# EAGLE schematic gatedriver_trafo_sma_compact_ACDC_ultra (EAGLE 7.2.0)
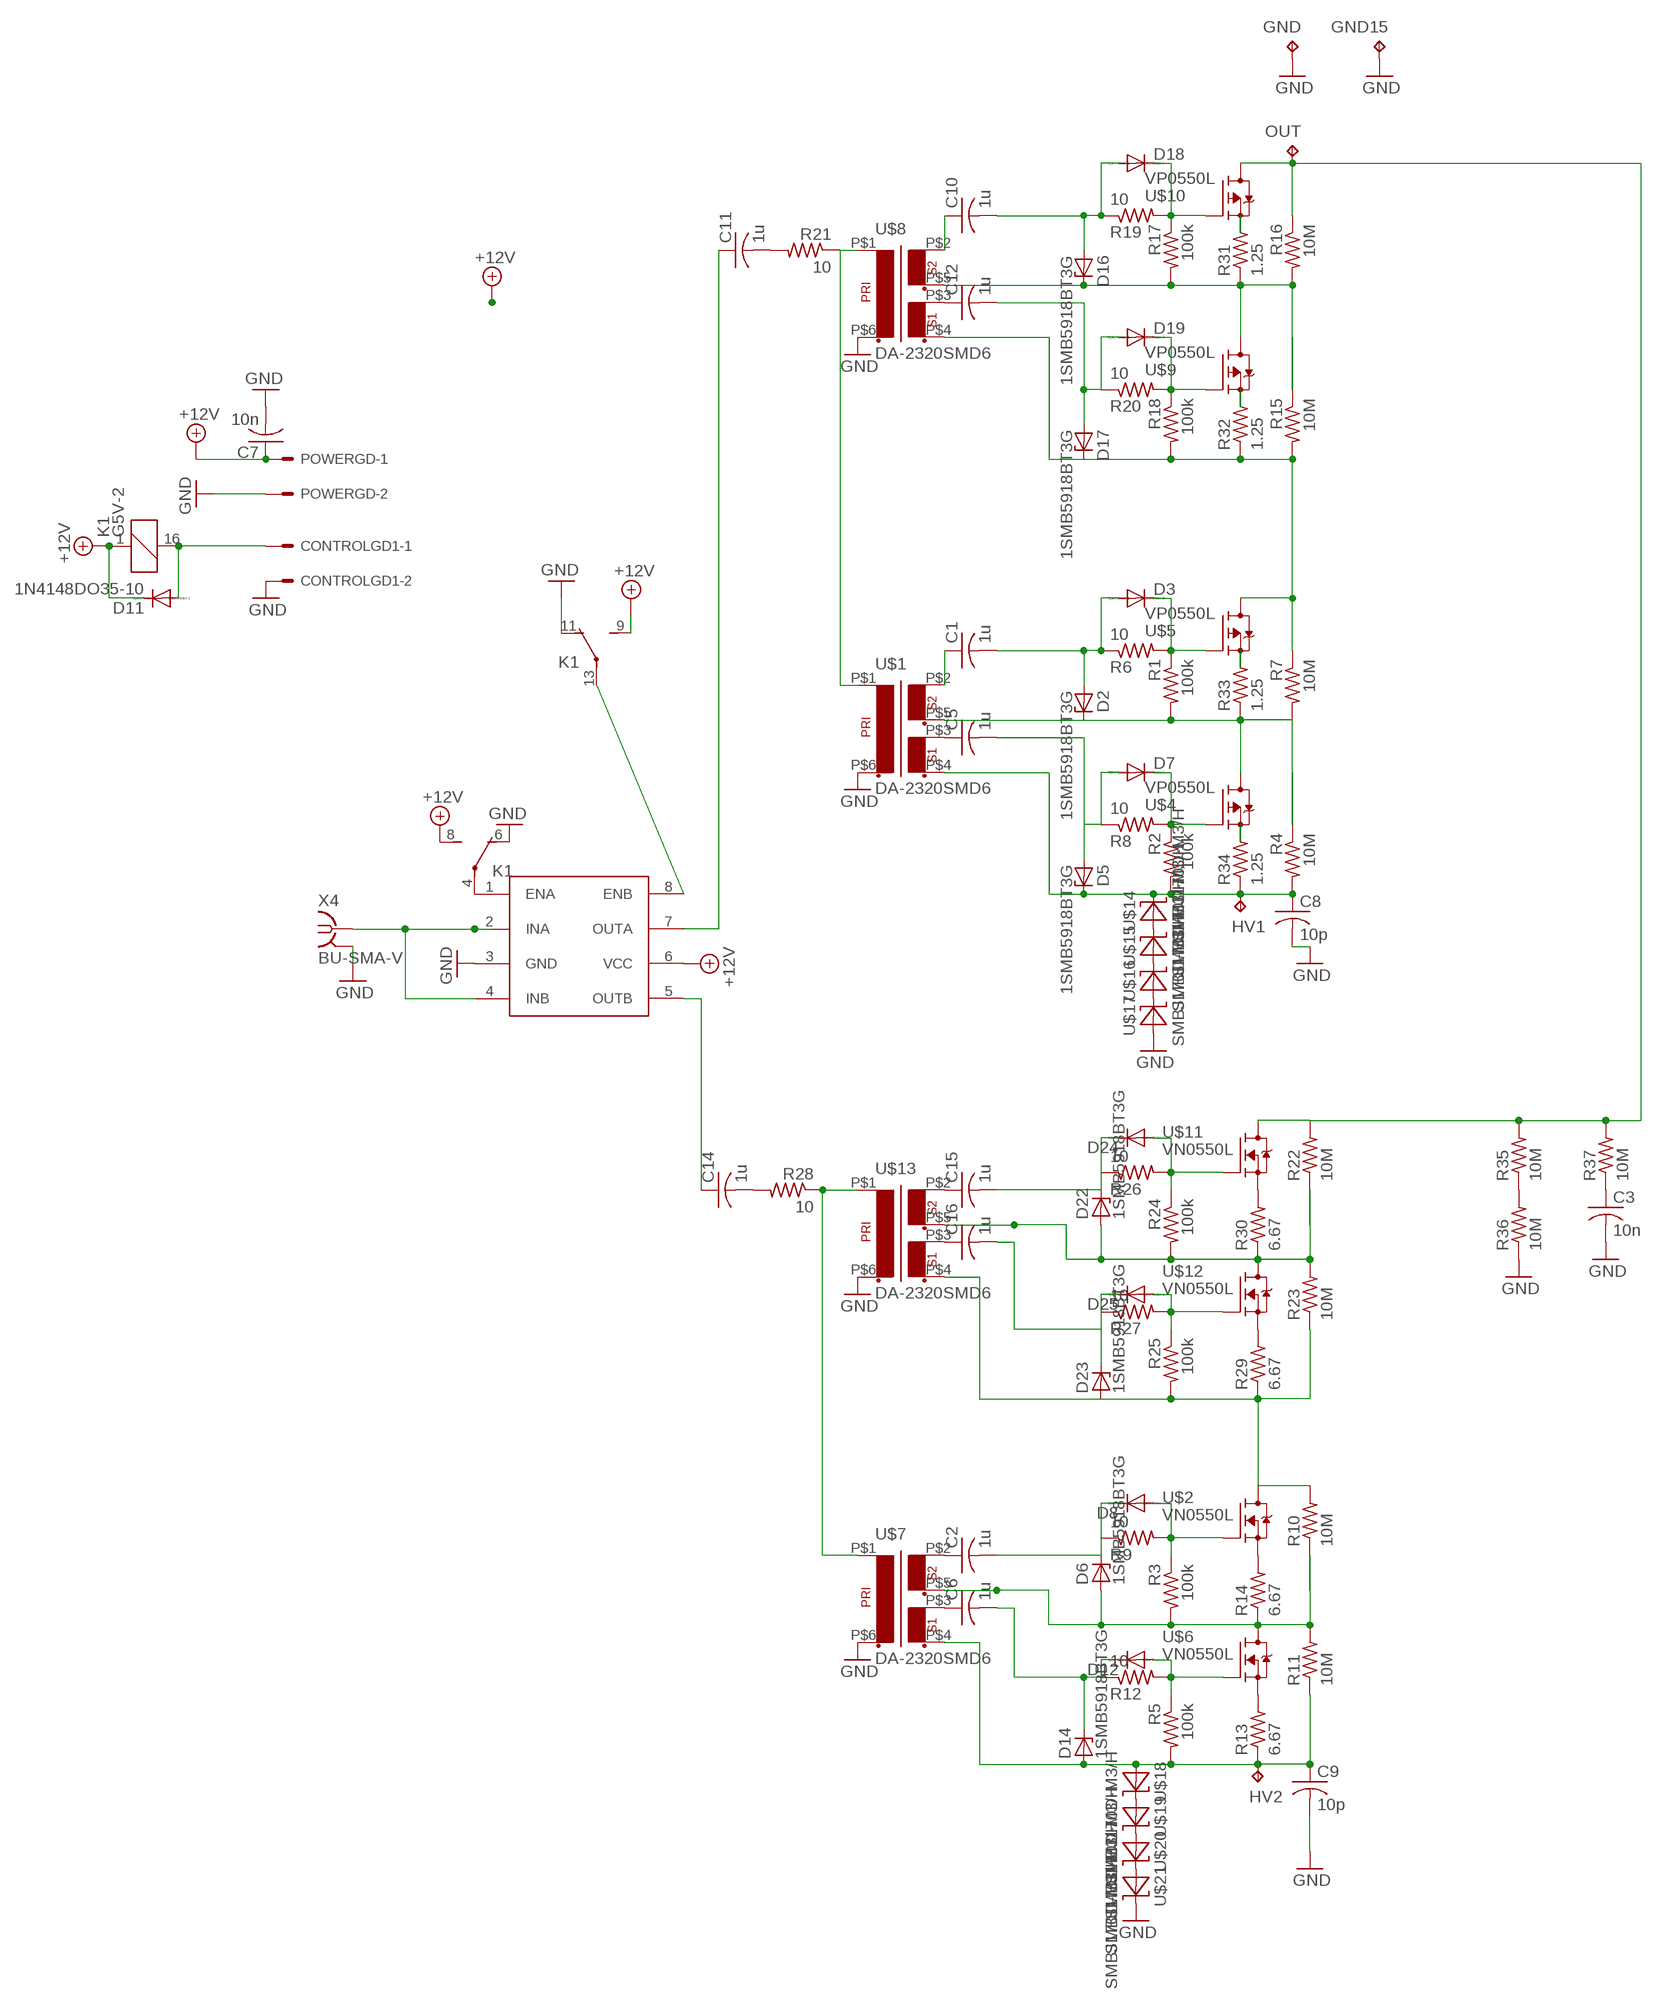
[diagram p0: schematic, sheet 1]

## Parts
C1  1u  C-USC0805  [C0805]
C2  1u  C-USC0805  [C0805]
C3  10n  C-USC0805  [C0805]
C5  1u  C-USC0805  [C0805]
C6  1u  C-USC0805  [C0805]
C7  10n  C-US050-030X075  [C050-030X075]
C8  10p  C-US102-064X133  [C102-064X133]
C9  10p  C-US102-064X133  [C102-064X133]
C10  1u  C-USC0805  [C0805]
C11  1u  C-USC0805  [C0805]
C12  1u  C-USC0805  [C0805]
C14  1u  C-USC0805  [C0805]
C15  1u  C-USC0805  [C0805]
C16  1u  C-USC0805  [C0805]
CONTROLGD1  KK-156-2  [KK-156-2]
D2  1SMB5918BT3G  ZENER-DIODESMB  [SMB]
D3  DIODE-SMB  [SMB]
D5  1SMB5918BT3G  ZENER-DIODESMB  [SMB]
D6  1SMB5918BT3G  ZENER-DIODESMB  [SMB]
D7  DIODE-SMB  [SMB]
D8  DIODE-SMB  [SMB]
D11  1N4148DO35-10  [DO35-10]
D12  DIODE-SMB  [SMB]
D14  1SMB5918BT3G  ZENER-DIODESMB  [SMB]
D16  1SMB5918BT3G  ZENER-DIODESMB  [SMB]
D17  1SMB5918BT3G  ZENER-DIODESMB  [SMB]
D18  DIODE-SMB  [SMB]
D19  DIODE-SMB  [SMB]
D22  1SMB5918BT3G  ZENER-DIODESMB  [SMB]
D23  1SMB5918BT3G  ZENER-DIODESMB  [SMB]
D24  DIODE-SMB  [SMB]
D25  DIODE-SMB  [SMB]
GND  TPPAD1-20Y  [P1-20Y]
GND15  TPPAD1-20Y  [P1-20Y]
HV1  TPPAD1-20Y  [P1-20Y]
HV2  TPPAD1-20Y  [P1-20Y]
K1  G5V-2  [G5V-2]
OUT  TPPAD1-20Y  [P1-20Y]
POWERGD  KK-156-2  [KK-156-2]
R1  100k  R-US_R0805  [R0805]
R2  100k  R-US_R0805  [R0805]
R3  100k  R-US_R0805  [R0805]
R4  10M  R-US_R2512  [R2512]
R5  100k  R-US_R0805  [R0805]
R6  10  R-US_R0805  [R0805]
R7  10M  R-US_R2512  [R2512]
R8  10  R-US_R0805  [R0805]
R9  10  R-US_R0805  [R0805]
R10  10M  R-US_R2512  [R2512]
R11  10M  R-US_R2512  [R2512]
R12  10  R-US_R0805  [R0805]
R13  6.67  R-US_R0805  [R0805]
R14  6.67  R-US_R0805  [R0805]
R15  10M  R-US_R2512  [R2512]
R16  10M  R-US_R2512  [R2512]
R17  100k  R-US_R0805  [R0805]
R18  100k  R-US_R0805  [R0805]
R19  10  R-US_R0805  [R0805]
R20  10  R-US_R0805  [R0805]
R21  10  R-US_R0805  [R0805]
R22  10M  R-US_R2512  [R2512]
R23  10M  R-US_R2512  [R2512]
R24  100k  R-US_R0805  [R0805]
R25  100k  R-US_R0805  [R0805]
R26  10  R-US_R0805  [R0805]
R27  10  R-US_R0805  [R0805]
R28  10  R-US_R0805  [R0805]
R29  6.67  R-US_R0805  [R0805]
R30  6.67  R-US_R0805  [R0805]
R31  1.25  R-US_R0805  [R0805]
R32  1.25  R-US_R0805  [R0805]
R33  1.25  R-US_R0805  [R0805]
R34  1.25  R-US_R0805  [R0805]
R35  10M  R-US_R2512  [R2512]
R36  10M  R-US_R2512  [R2512]
R37  10M  R-US_R2512  [R2512]
U$1  DA-2320SMD6  [SMD6]
U$2  VN0550L  [TO92L]
U$3  UCC27425  [DIL08]
U$4  VP0550L  [TO92L]
U$5  VP0550L  [TO92L]
U$6  VN0550L  [TO92L]
U$7  DA-2320SMD6  [SMD6]
U$8  DA-2320SMD6  [SMD6]
U$9  VP0550L  [TO92L]
U$10  VP0550L  [TO92L]
U$11  VN0550L  [TO92L]
U$12  VN0550L  [TO92L]
U$13  DA-2320SMD6  [SMD6]
U$14  SMBJ170D-M3/H  [DO214AA]
U$15  SMBJ170D-M3/H  [DO214AA]
U$16  SMBJ170D-M3/H  [DO214AA]
U$17  SMBJ170D-M3/H  [DO214AA]
U$18  SMBJ170D-M3/H  [DO214AA]
U$19  SMBJ170D-M3/H  [DO214AA]
U$20  SMBJ170D-M3/H  [DO214AA]
U$21  SMBJ170D-M3/H  [DO214AA]
X4  BU-SMA-V  [BU-SMA-V]

## Nets
+15V: C7.1 D11.C K1.1 K1.8(1:S) K1.9(2:S) POWERGD.1 U$3.6(VCC) ; supply symbol labelled +12V
ENSW: CONTROLGD1.1 D11.A K1.16
GND: C3.2 C7.2 C8.2 C9.2 CONTROLGD1.2 GND15.TP GND.TP K1.6(1:O) K1.11(2:O) POWERGD.2 R36.1 U$1.P$6 U$3.3(GND) U$7.P$6 U$8.P$6 U$13.P$6 U$17.A U$21.C X4.2 X4.3 X4.4 X4.5
N$1: U$3.2(INA) U$3.4(INB) X4.1
N$2: C11.1 U$3.7(OUTA)
N$3: R13.2 U$6.3(S)
N$4: C14.1 U$3.5(OUTB)
N$5: C1.1 U$1.P$2
N$6: R14.2 U$2.3(S)
N$7: C5.1 U$1.P$3
N$8: D3.C R1.1 R6.2 U$5.2(G)
N$9: R29.2 U$12.3(S)
N$10: C1.2 D2.A D3.A R6.1
N$11: D12.A R5.1 R12.2 U$6.2(G)
N$12: D7.C R2.1 R8.2 U$4.2(G)
N$13: D6.A R3.2 R10.1 R11.2 R14.1 U$6.1(D) U$7.P$5
N$14: K1.4(1:P) U$3.1(ENA)
N$15: K1.13(2:P) U$3.8(ENB)
N$16: C5.2 D5.A D7.A R8.1
N$17: C8.1 D5.C HV1.TP R2.2 R4.2 R34.1 U$1.P$4 U$14.C
N$18: D2.C R1.2 R4.1 R7.2 R33.1 U$1.P$5 U$4.1(D)
N$19: R30.2 U$11.3(S)
N$20: R34.2 U$4.3(S)
N$21: R33.2 U$5.3(S)
N$22: C2.1 U$7.P$2
N$23: C6.1 U$7.P$3
N$24: C9.1 D14.A HV2.TP R5.2 R11.1 R13.1 U$7.P$4 U$18.A
N$25: C2.2 D6.C D8.C R9.1
N$26: OUT.TP R16.1 R22.2 R35.2 R37.2 U$10.1(D) U$11.1(D)
N$27: C6.2 D12.C D14.C R12.1
N$28: C10.1 U$8.P$2
N$29: C12.1 U$8.P$3
N$30: C12.2 D17.A D19.A R20.1
N$31: R31.2 U$10.3(S)
N$32: D17.C R7.1 R15.2 R18.2 R32.1 U$5.1(D) U$8.P$4
N$33: D16.C R15.1 R16.2 R17.2 R31.1 U$8.P$5 U$9.1(D)
N$34: D18.C R17.1 R19.2 U$10.2(G)
N$35: C10.2 D16.A D18.A R19.1
N$36: D19.C R18.1 R20.2 U$9.2(G)
N$37: R21.1 U$1.P$1 U$8.P$1
N$38: C11.2 R21.2
N$39: R32.2 U$9.3(S)
N$40: C15.1 U$13.P$2
N$41: C16.1 U$13.P$3
N$42: C15.2 D22.C D24.C R26.1
N$43: C16.2 D23.C D25.C R27.1
N$44: R35.1 R36.2
N$45: C3.1 R37.1
N$46: D22.A R22.1 R23.2 R24.2 R30.1 U$12.1(D) U$13.P$5
N$47: D25.A R25.1 R27.2 U$12.2(G)
N$48: R28.1 U$7.P$1 U$13.P$1
N$49: C14.2 R28.2
N$50: D24.A R24.1 R26.2 U$11.2(G)
N$51: D23.A R10.2 R23.1 R25.2 R29.1 U$2.1(D) U$13.P$4
N$52: U$14.A U$15.C
N$53: U$15.A U$16.C
N$54: U$16.A U$17.C
N$55: U$18.C U$19.A
N$56: U$19.C U$20.A
N$57: U$20.C U$21.A
N$251: D8.A R3.1 R9.2 U$2.2(G)

## Library data of the parts
C1-C3 C5 C6 C8-C12 C14-C16 = resistor:C-US: CAPACITOR, American symbol
C7 = rcl:C-US: CAPACITOR, American symbol
CONTROLGD1 POWERGD = con-molex:KK-156-2: KK 156 HEADER Source: http://www.molex.com/pdm_docs/sd/026604100_sd.pdf; OC_FARNELL: unknown; OC_NEWARK: unknown
D2 D5 D6 D14 D16 D17 D22 D23 = diode:ZENER-DIODE: Z-Diode
D3 D7 D8 D12 D18 D19 D24 D25 = diode:DIODE-: DIODE
D11 = diode:1N4148: DIODE high speed (Philips)
GND GND15 HV1 HV2 OUT = testpad:TP: Test pad
K1 = relay:G5V-2: OMRON PCB Relay Source: http://www.omron.com/ecb/products/pdf/en-g5v2.pdf; MPN: G5V-2 5DC; OC_FARNELL: 9949488; OC_NEWARK: 78K5703
R1-R37 = rcl:R-US_: RESISTOR, American symbol
U$1 U$7 U$8 U$13 = trafo:DA-2320
U$2 U$6 U$11 U$12 = transistor-fet:VN0550
U$3 = texas:UCC27425
U$4 U$5 U$9 U$10 = transistor-fet:VP0550
U$14-U$21 = diode:SMBJ170D-M3/H
X4 = con-coax:BU-SMA-V: FEMALE SMA CONNECTOR Radiall distributor RS 112-3794; OC_FARNELL: unknown; OC_NEWARK: unknown